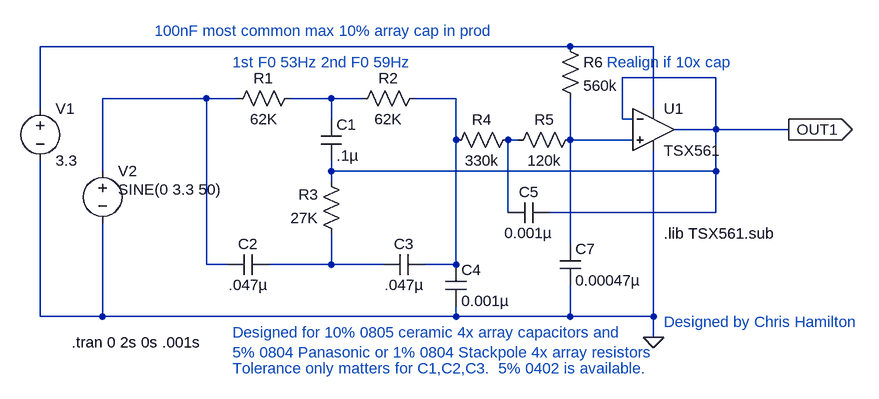
[diagram p0: schematic ECGACTNTCHLPBFR.asc]
ECGACTNTCHLPBFR.asc, the LTspice schematic file:
Version 4
SHEET 1 880 680
WIRE 64 0 -752 0
WIRE 192 0 64 0
WIRE 288 48 144 48
WIRE -496 80 -656 80
WIRE -448 80 -496 80
WIRE -304 80 -368 80
WIRE -256 80 -304 80
WIRE -112 80 -176 80
WIRE -752 96 -752 0
WIRE 192 96 192 0
WIRE -304 112 -304 80
WIRE 144 112 144 48
WIRE 160 112 144 112
WIRE 288 128 288 48
WIRE 288 128 224 128
WIRE 400 128 288 128
WIRE -112 144 -112 80
WIRE -16 144 -32 144
WIRE 64 144 64 80
WIRE 160 144 64 144
WIRE -656 192 -656 80
WIRE -304 192 -304 176
WIRE 288 192 288 128
WIRE 288 192 -304 192
WIRE -304 208 -304 192
WIRE -32 256 -32 144
WIRE 288 256 288 192
WIRE 288 256 32 256
WIRE 64 304 64 144
WIRE -496 336 -496 80
WIRE -464 336 -496 336
WIRE -304 336 -304 288
WIRE -304 336 -400 336
WIRE -224 336 -304 336
WIRE -112 336 -112 144
WIRE -112 336 -160 336
WIRE -752 416 -752 176
WIRE -656 416 -656 272
WIRE -656 416 -752 416
WIRE -112 416 -112 400
WIRE -112 416 -656 416
WIRE 64 416 64 368
WIRE 64 416 -112 416
WIRE 192 416 192 160
WIRE 192 416 64 416
WIRE 192 448 192 416
FLAG 192 448 0
FLAG 400 128 OUT1
IOPIN 400 128 Out
SYMBOL res -352 64 R90
WINDOW 0 0 56 VBottom 2
WINDOW 3 32 56 VTop 2
SYMATTR InstName R1
SYMATTR Value 62K
SYMATTR SpiceLine tol=1%
SYMBOL res -160 64 R90
WINDOW 0 0 56 VBottom 2
WINDOW 3 32 56 VTop 2
SYMATTR InstName R2
SYMATTR Value 62K
SYMATTR SpiceLine tol=1%
SYMBOL res -288 304 R180
WINDOW 0 36 76 Left 2
WINDOW 3 36 40 Left 2
SYMATTR InstName R3
SYMATTR Value 27K
SYMBOL cap -320 112 R0
SYMATTR InstName C1
SYMATTR Value .1µ
SYMBOL cap -400 320 R90
WINDOW 0 0 32 VBottom 2
WINDOW 3 32 32 VTop 2
SYMATTR InstName C2
SYMATTR Value .047µ
SYMBOL cap -160 320 R90
WINDOW 0 0 32 VBottom 2
WINDOW 3 32 32 VTop 2
SYMATTR InstName C3
SYMATTR Value .047µ
SYMBOL voltage -752 80 R0
WINDOW 123 0 0 Left 2
WINDOW 39 0 0 Left 2
SYMATTR InstName V1
SYMATTR Value 3.3
SYMBOL voltage -656 176 R0
WINDOW 123 24 124 Left 2
WINDOW 39 0 0 Left 2
WINDOW 3 24 44 Left 2
SYMATTR Value SINE(0 3.3 50)
SYMATTR InstName V2
SYMBOL res -16 128 R90
WINDOW 0 0 56 VBottom 2
WINDOW 3 32 56 VTop 2
SYMATTR InstName R4
SYMATTR Value 330k
SYMBOL cap -128 336 R0
SYMATTR InstName C4
SYMATTR Value 0.001µ
SYMBOL cap 32 240 R90
WINDOW 0 0 32 VBottom 2
WINDOW 3 32 32 VTop 2
SYMATTR InstName C5
SYMATTR Value 0.001µ
SYMBOL res 80 128 R90
WINDOW 0 0 56 VBottom 2
WINDOW 3 32 56 VTop 2
SYMATTR InstName R5
SYMATTR Value 120k
SYMATTR SpiceLine tol=1%
SYMBOL cap 48 304 R0
SYMATTR InstName C7
SYMATTR Value 0.00047µ
SYMBOL res 48 -16 R0
SYMATTR InstName R6
SYMATTR Value 560k
SYMBOL Opamps\\opamp2 192 64 R0
SYMATTR InstName U1
SYMATTR Value TSX561
TEXT 208 288 Left 2 !.lib TSX561.sub
TEXT -704 456 Left 2 !.tran 0 2s 0s .001s
TEXT -456 440 Left 2 ;Designed for 10% 0805 ceramic 4x array capacitors and \n5% 0804 Panasonic or 1% 0804 Stackpole 4x array resistors
TEXT -456 24 Left 2 ;1st F0 53Hz 2nd F0 59Hz
TEXT 120 24 Left 2 ;Realign if 10x cap
TEXT -576 -24 Left 2 ;100nF most common max 10% array cap in prod
TEXT 208 424 Left 2 ;Designed by Chris Hamilton
TEXT -456 496 Left 2 ;Tolerance only matters for C1,C2,C3.  5% 0402 is available.

The netlist it stands for:
* ECGACTNTCHLPBFR.asc
R1 N003 N002 62K tol=1%
R2 N004 N003 62K tol=1%
R3 N007 OUT1 27K
C1 N003 OUT1 .1µ
C2 N007 N002 .047µ
C3 N004 N007 .047µ
V1 N001 0 3.3
V2 N002 0 SINE(0 3.3 50)
R4 N005 N004 330k
C4 N004 0 0.001µ
C5 OUT1 N005 0.001µ
R5 N006 N005 120k tol=1%
C7 N006 0 0.00047µ
R6 N001 N006 560k
XU1 N006 OUT1 N001 0 OUT1 TSX561  ; pins In+ In- V+ V- OUT
.lib TSX561.sub
.tran 0 2s 0s .001s
* Designed for 10% 0805 ceramic 4x array capacitors and
* 5% 0804 Panasonic or 1% 0804 Stackpole 4x array resistors
* 1st F0 53Hz 2nd F0 59Hz
* Realign if 10x cap
* 100nF most common max 10% array cap in prod
* Designed by Chris Hamilton
* Tolerance only matters for C1,C2,C3.  5% 0402 is available.
.backanno
.end